# EAGLE design buttons (EAGLE 7.7.0)
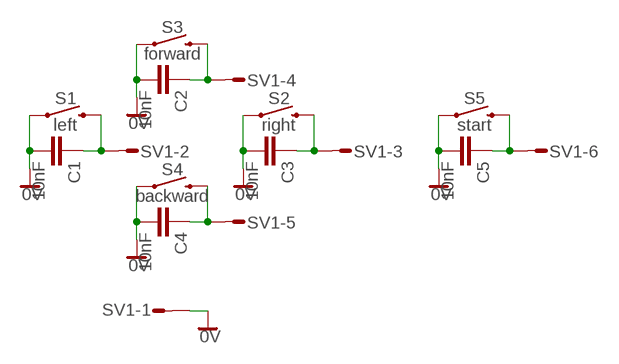
[diagram p0: schematic, sheet 1]

## Parts
C1  10nF  C-EUC0805K  [C0805K]
C2  10nF  C-EUC0805K  [C0805K]
C3  10nF  C-EUC0805K  [C0805K]
C4  10nF  C-EUC0805K  [C0805K]
C5  10nF  C-EUC0805K  [C0805K]
S1  left  MOMENTARY-SWITCH-SPST-SMD-12MM  [TACTILE_SWITCH_SMD_12MM]
S2  right  MOMENTARY-SWITCH-SPST-SMD-12MM  [TACTILE_SWITCH_SMD_12MM]
S3  forward  MOMENTARY-SWITCH-SPST-SMD-12MM  [TACTILE_SWITCH_SMD_12MM]
S4  backward  MOMENTARY-SWITCH-SPST-SMD-12MM  [TACTILE_SWITCH_SMD_12MM]
S5  start  MOMENTARY-SWITCH-SPST-SMD-12MM  [TACTILE_SWITCH_SMD_12MM]
SV1  S06P  [S06P]

## Nets
0V: C1.2 C2.2 C3.2 C4.2 C5.2 S1.1 S2.1 S3.1 S4.1 S5.1 SV1.1
N$1: C1.1 S1.3 SV1.2
N$2: C3.1 S2.3 SV1.3
N$3: C2.1 S3.3 SV1.4
N$4: C4.1 S4.3 SV1.5
N$5: C5.1 S5.3 SV1.6

## Library data of the parts
C1-C5 = rcl:C-EU: CAPACITOR, European symbol
S1-S5 = SparkFun-Switches:MOMENTARY-SWITCH-SPST: Momentary Switch (Pushbutton) - SPST Normally-open (NO) SPST momentary switches (buttons, pushbuttons). Variants PTH-12MM - 12mm square, through-hole Momentary Pushbutton Switch - 12mm Square <https://www.sparkfun.com/products/9190> (COM-09190) PTH-6.0MM, PTH-6.0MM-KIT - 6.0mm square, through-hole Mini Pushbutton Switch <https://www.sparkfun.com/products/97> (COM-00097) KIT package intended for soldering kit's - only one side of pads' copper is exposed. PTH-RIGHT-ANGLE-KIT - Right-angle, through-hole Right Angle Tactile Button <https://www.sparkfun.com/products/10791> - Used on SparkFun BigTime Watch Kit <https://www.sparkfun.com/products/11734> SMD-12MM - 12mm square, surface-mount Tactile Button - SMD (12mm) <https://www.sparkfun.com/products/12993> (COM-12993) Used on SparkFun PicoBoard <https://www.sparkfun.com/products/11888> SMD-4.5MM - 4.5mm Square Trackball Switch Used on SparkFun Blackberry Trackballer Breakout <https://www.sparkfun.com/products/13169> SMD-4.6MMX2.8MM - 4.60mm x 2.80mm, surface mount Used on SparkFun SAMD21 Mini Breakout <https://www.sparkfun.com/products/13664> SMD-5.2MM, SMD-5.2-REDUNDANT - 5.2mm square, surface-mount Mini Pushbutton Switch - SMD <https://www.sparkfun.com/products/8720> (COM-08720) Used on Arduino Pro Mini <https://www.sparkfun.com/products/11114> REDUNDANT package connects both switch circuits together SMD-6.0X3.5MM - 6.0 x 3.5mm, surface mount Momentary Reset Switch SMD <https://www.sparkfun.com/products/8229> (COM-08229) SMD-6.2MM-TALL - 6.2mm square, surface mount Tactile Button - SMD (6mm) <https://www.sparkfun.com/products/12992> Used on SparkFun Digital Sandbox <https://www.sparkfun.com/products/12651> SMD-RIGHT-ANGLE - Right-angle, surface mount Used on SparkFun Block for Intel® Edison - Arduino <https://www.sparkfun.com/products/13036>; PROD_ID: SWCH-11967; SF_SKU: COM-12993
SV1 = con-amp-mt:S06P: AMP MT CONNECTOR; OC_FARNELL: unknown; OC_NEWARK: unknown

## Board
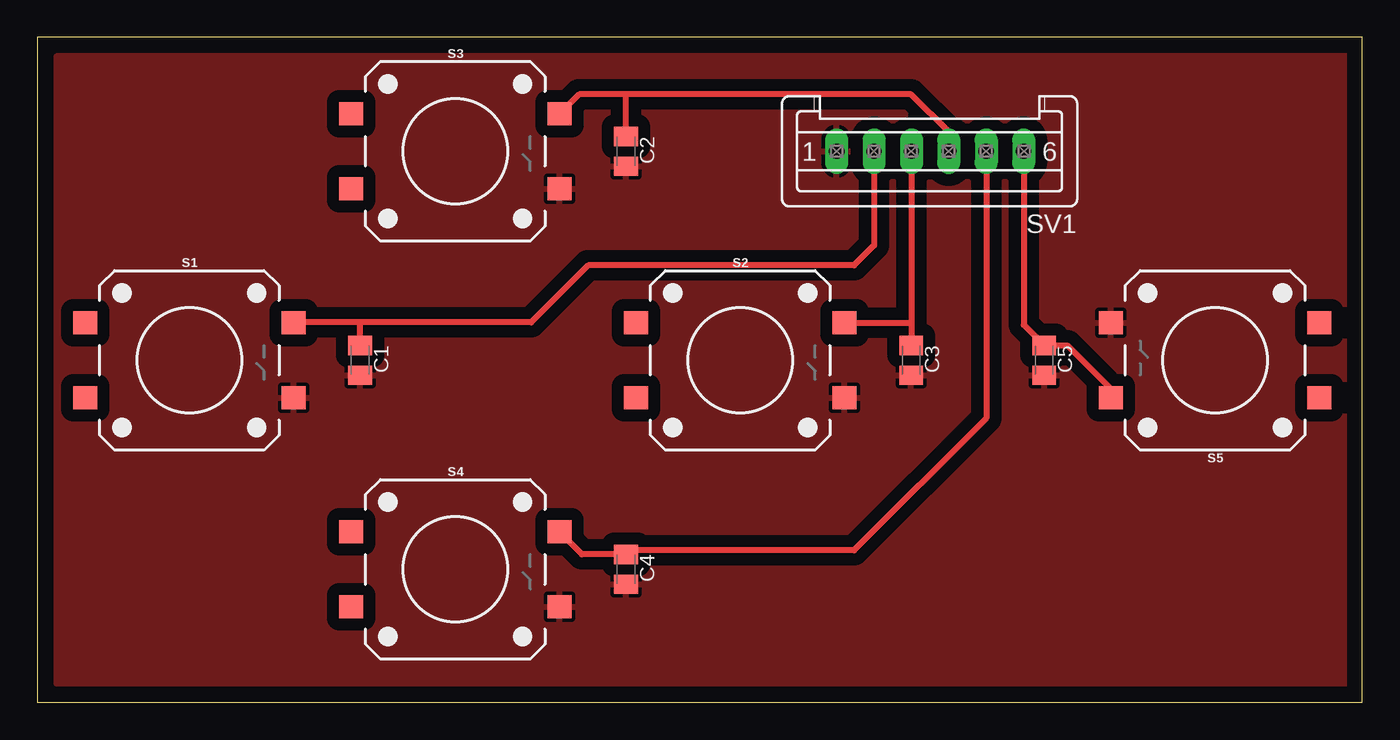
[diagram p1: board, top side]

Size 88.57 x 44.44 mm. Coordinates in mm from the lower left corner, seen from the top.
Outline: 0,0 88.57,0 88.57,44.44 0,44.44 0,0
Copper layers (1*16): Top 0.035mm / dielectric 1.5mm / Bottom 0.035mm
Design rules "default": minimum track width 10mil, minimum drill 24mil, track to track 8mil, track to pad 8mil, pad to pad 8mil, via to via 8mil, smd to smd 8mil, copper to edge 40mil, drill to drill 8mil, minimum pad ring 10mil, minimum via ring 8mil, stop-mask expansion 4mil, vias tented up to drill 0mil, thermal gap 10mil

### Footprints (pad centres in the part's own frame; a part is rotated, then mirrored left to right if it is on the bottom)
C0805K = smd 1.3 x 1.6: 1 -1,0; 2 1,0
TACTILE_SWITCH_SMD_12MM = smd 1.6 x 1.55: 1 6.975,-2.5; 2 -6.975,-2.5; 3 6.975,2.5; 4 -6.975,2.5
S06P = drill 1.016 long: 1 6.25,0; 2 3.75,0; 3 1.25,0; 4 -1.25,0; 5 -3.75,0; 6 -6.25,0

### Placement (x,y rotation side)
C1  21.59,22.86 270 top
C2  39.37,36.83 270 top
C3  58.42,22.86 270 top
C4  39.37,8.89 270 top
C5  67.31,22.86 270 top
S1  10.16,22.86 0 top
S2  46.99,22.86 0 top
S3  27.94,36.83 0 top
S4  27.94,8.89 0 top
S5  78.74,22.86 180 top
SV1  59.69,36.83 180 top

### Tracks (layer width: path | path; a pad name or v marks a point on that pad's centre or on a via)
0V
  pour Top (isolate 0.813): 1.27,43.18 1.27,1.27 87.63,1.27 87.63,43.18
N$1
  Top 0.406: SV1.2 55.94,30.54 54.61,29.21 36.83,29.21 33.02,25.4 21.59,25.4 | 21.59,25.4 17.18,25.4 S1.3 | C1.1 21.59,25.4
N$2
  Top 0.406: SV1.3 58.44,25.4 | 58.44,25.4 58.44,23.88 C3.1 | S2.3 58.4,25.36 58.44,25.4
N$3
  Top 0.406: SV1.4 60.94,38.12 58.42,40.64 39.37,40.64 | 39.37,40.64 36.22,40.64 S3.3 | C2.1 39.37,40.64
N$4
  Top 0.406: SV1.5 63.44,18.99 54.61,10.16 39.64,10.16 C4.1 36.41,9.89 S4.3
N$5
  Top 0.406: SV1.6 65.94,25.23 C5.1 68.85,23.86 71.77,20.95 S5.3

### Text on the board
tDocu: Lemur's Bobik / buttons board / v1.0